# EAGLE design in3temperature (EAGLE 8.0.0)
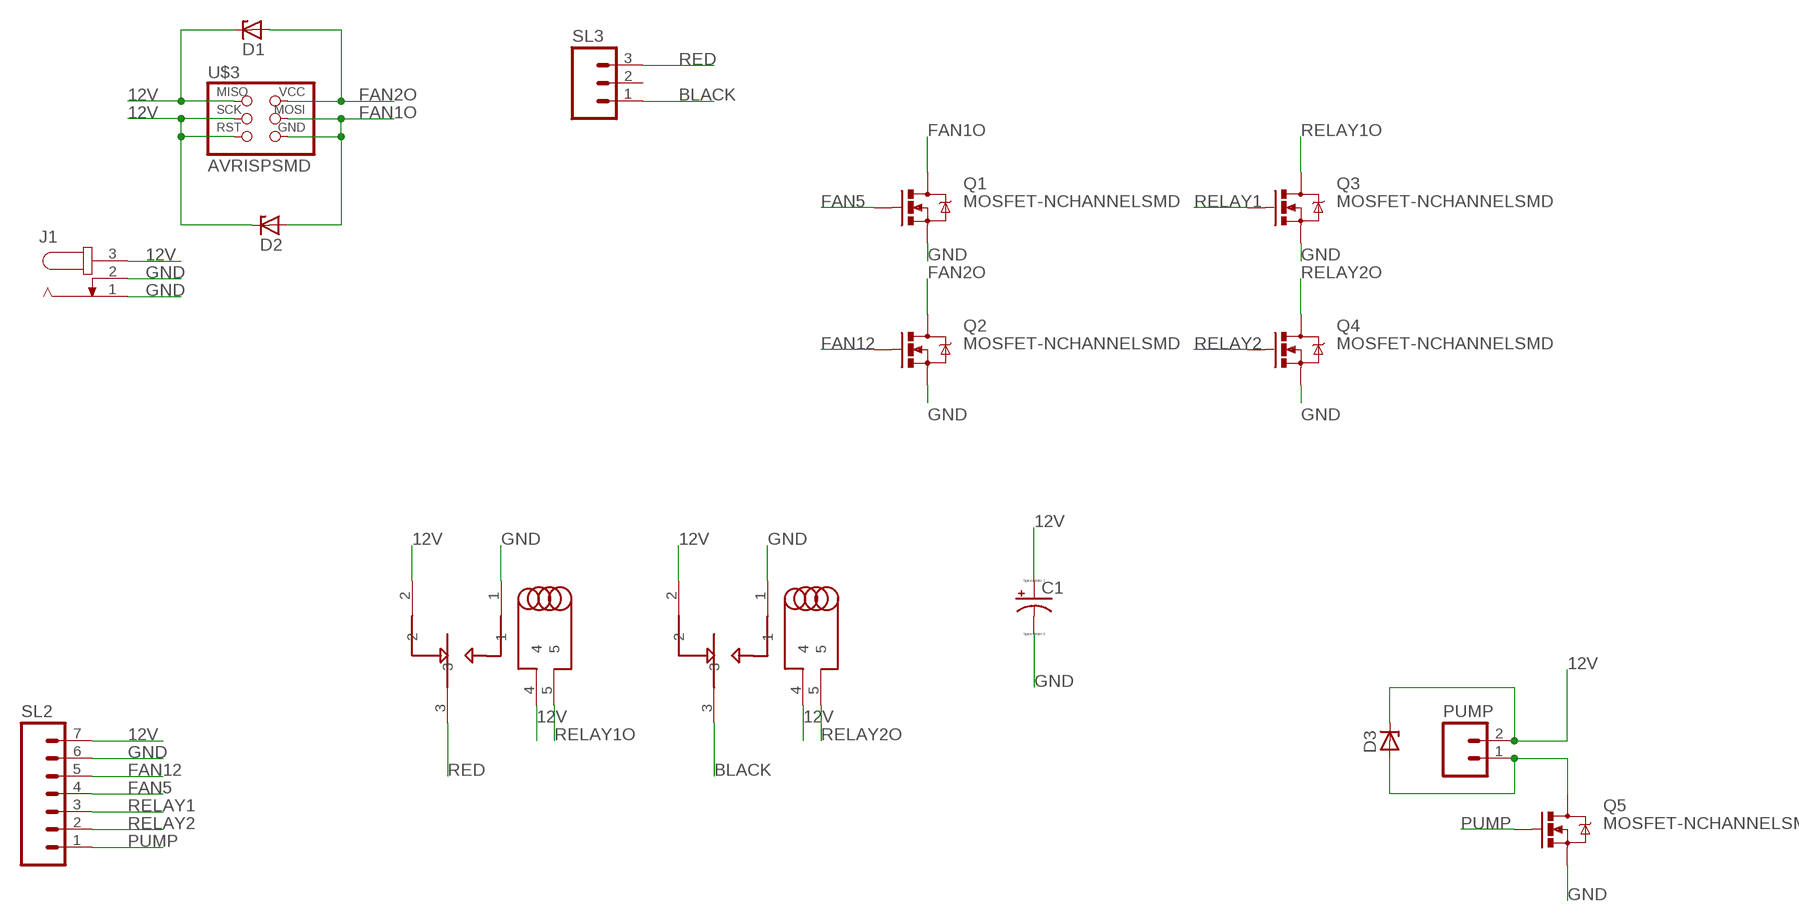
[diagram p0: schematic, sheet 1]

## Parts
C1  CPOL-USE2.5-5  [E2,5-5]
D1  ZENER_DIODESOD123  [SOD123]
D2  ZENER_DIODESOD123  [SOD123]
D3  ZENER_DIODESOD123  [SOD123]
J1  JACK-PLUG1  [SPC4078]
PUMP  MA02  [02PA]
Q1  MOSFET-NCHANNELSMD  [SOT23-3]
Q2  MOSFET-NCHANNELSMD  [SOT23-3]
Q3  MOSFET-NCHANNELSMD  [SOT23-3]
Q4  MOSFET-NCHANNELSMD  [SOT23-3]
Q5  MOSFET-NCHANNELSMD  [SOT23-3]
SL2  MA07  [07PA]
SL3  MA03  [03P]
U$1  RELAY-V23092THROUGH_HOLE  [RELAY-V23092]
U$2  RELAY-V23092THROUGH_HOLE  [RELAY-V23092]
U$3  AVRISPSMD  [2X03SMD]

## Nets
12V: C1.+ D1.CATHODE D2.CATHODE D3.CATHODE J1.3 PUMP.2 SL2.7 U$1.2 U$1.4 U$2.2 U$2.4 U$3.1(MISO) U$3.3(SCK) U$3.5(RST)
BLACK: SL3.1 U$2.3
FAN1O: D2.ANODE Q1.3(D) U$3.4(MOSI) U$3.6(GND)
FAN2O: D1.ANODE Q2.3(D) U$3.2(VCC)
FAN5: Q1.1(G) SL2.4
FAN12: Q2.1(G) SL2.5
GND: C1.- J1.1 J1.2 Q1.2(S) Q2.2(S) Q3.2(S) Q4.2(S) Q5.2(S) SL2.6 U$1.1 U$2.1
N$3: D3.ANODE PUMP.1 Q5.3(D)
PUMP: Q5.1(G) SL2.1
RED: SL3.3 U$1.3
RELAY1: Q3.1(G) SL2.3
RELAY1O: Q3.3(D) U$1.5
RELAY2: Q4.1(G) SL2.2
RELAY2O: Q4.3(D) U$2.5
Unconnected: SL3.2

## Library data of the parts
C1 = resistor:CPOL-US: POLARIZED CAPACITOR, American symbol
D1-D3 = fab:ZENER_DIODE: zener diode
J1 = con-jack:JACK-PLUG: DC POWER JACK Power Jack, DC, Right Angle, Through Hole, Rated 5A at 16VDC, PC Terminals Distributor: Farnell (www.Farnell.de) Drawing: 84N1161.pdf / 84N1162.pdf Manufacturer: SPC Technology (www.spctechnology.com) Type: SPC4077 / SPC 4078; OC_FARNELL: unknown; OC_NEWARK: unknown
PUMP = con-amp-quick:MA02: AMP QUICK CONNECTOR; OC_FARNELL: unknown; OC_NEWARK: unknown
Q1-Q5 = 01_SparkFun:MOSFET-NCHANNEL
SL2 = con-amp-quick:MA07: AMP QUICK CONNECTOR; OC_FARNELL: unknown; OC_NEWARK: unknown
SL3 = con-amp-quick:MA03: AMP QUICK CONNECTOR; OC_FARNELL: unknown; OC_NEWARK: unknown
U$1 U$2 = 0001_alejandro:RELAY-V23092
U$3 = 01_FAB_Hello:AVRISP

## Board
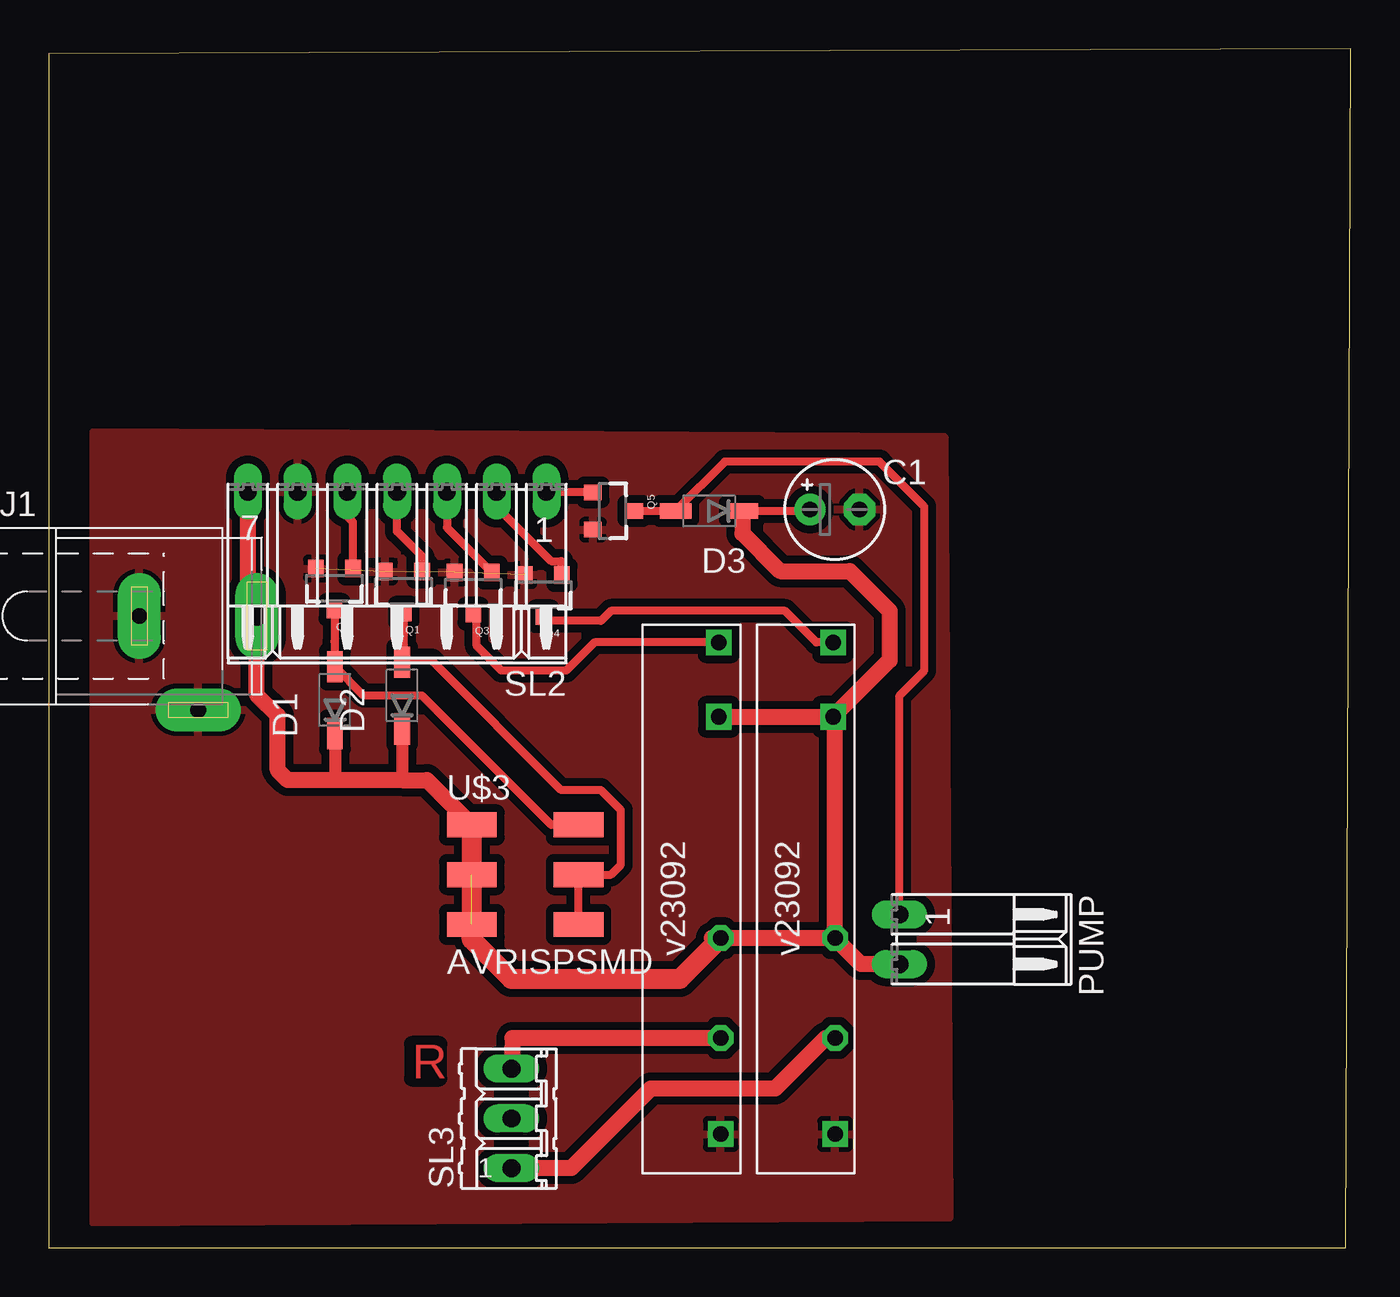
[diagram p1: board, top side]

Size 66.47 x 61.2 mm. Coordinates in mm from the lower left corner, seen from the top.
Outline: 0,0 66.22,0 66.47,61.2 0,60.95 0,0
Copper layers (1*16): Top 0.035mm / dielectric 1.5mm / Bottom 0.035mm
Design rules "default *": minimum track width 10mil, minimum drill 24mil, track to track 16mil, track to pad 16mil, pad to pad 16mil, via to via 16mil, smd to smd 16mil, copper to edge 40mil, drill to drill 8mil, minimum pad ring 10mil, minimum via ring 8mil, stop-mask expansion 4mil, vias tented up to drill 0mil, thermal gap 10mil

### Footprints (pad centres in the part's own frame; a part is rotated, then mirrored left to right if it is on the bottom)
E2,5-5 = drill 0.813 pad 1.6: + -1.27,0 | drill 0.813 pad 1.6 octagon: - 1.27,0
SOD123 = smd 1.6 x 0.8: ANODE 1.7,0; CATHODE -1.7,0
SPC4078 = drill 0.8 pad 2.184 long: 1 -3,0; 2 0,-4.8 | drill 1 pad 2.184 long: 3 3,0
02PA = drill 0.914 long: 1 -1.27,0; 2 1.27,0
SOT23-3 = smd 0.8 x 0.9: 1 -0.95,-1; 2 0.95,-1; 3 0,1.1
07PA = drill 0.914 long: 1 -7.62,0; 2 -5.08,0; 3 -2.54,0; 4 0,0; 5 2.54,0; 6 5.08,0; 7 7.62,0
03P = drill 0.914 long: 1 -2.54,0; 2 0,0; 3 2.54,0
RELAY-V23092 = drill 0.8 square: 1 2,1; 4 23.3,1.1; 5 27.1,1.1 | drill 0.8 octagon: 2 12,1; 3 6.9,1
2X03SMD = smd 2.54 x 1.27: 1 -2.54,2.54; 2 2.92,2.54; 3 -2.54,0; 4 2.92,0; 5 -2.54,-2.54; 6 2.92,-2.54

### Placement (x,y rotation side)
C1  40.13,37.69 0 top
D1  14.61,27.97 90 top
D2  18.03,28.19 90 top
D3  33.71,37.62 180 top
J1  7.62,32.26 0 top
PUMP  43.43,15.75 270 top
Q1  18.11,33.53 180 top
Q2  14.58,33.68 180 top
Q3  21.67,33.48 180 top
Q4  25.25,33.35 180 top
Q5  28.78,37.62 270 top
SL2  17.78,38.61 180 top
SL3  23.62,6.6 90 top
U$1  35.31,3.81 90 top
U$2  41.15,3.81 90 top
U$3  24.13,19.05 0 top

### Tracks (layer width: path | path; a pad name or v marks a point on that pad's centre or on a via)
12V  (1 unrouted)
  Top 0.406: 22.35,21.59 U$3.1 | D3.CATHODE 38.53,37.62 C1.+
  Top 0.61: D1.CATHODE 14.61,24 14.48,23.88 | D2.CATHODE 18.03,23.88
  Top 0.813: SL2.7 10.16,32.72 J1.3 10.62,28.24 11.68,27.18 11.68,24.38 12.19,23.88 14.48,23.88 18.03,23.88 19.3,23.88 U$3.1 | U$2.2 U$1.2 33.84,15.81 | U$1.4 U$2.4 | U$2.2 40.15,27.01 U$2.4 | D3.CATHODE 35.41,36.48 37.34,34.54 40.89,34.54 42.93,32.51 42.93,29.99 U$2.4 | PUMP.2 41.48,14.48 U$2.2
  Top 1.016: U$1.2 32.21,13.72 23.62,13.72 21.59,15.75 U$3.5 U$3.1
BLACK
  Top 0.813: U$2.3 39.67,10.71 37.08,8.13 30.73,8.13 26.67,4.06 SL3.1
FAN1O
  Top 0.406: Q1.3 18.11,29.97 D2.ANODE 18.11,29.97 19.56,29.97 26.16,23.37 28.19,23.37 29.21,22.35 29.21,19.56 28.7,19.05 U$3.4 U$3.6
FAN2O
  Top 0.406: Q2.3 14.58,30.96 D1.ANODE 16.08,28.19 19.05,28.19 25.65,21.59 U$3.2
FAN5
  Top 0.406: Q1.1 19.06,35.3 17.78,36.58 SL2.4
FAN12
  Top 0.406: Q2.1 15.53,37.05 15.24,37.34 SL2.5
GND  (3 unrouted)
  pour Top: 45.72,41.4 45.97,1.52 2.29,1.27 2.29,41.66
N$3
  Top 0.406: Q5.3 D3.ANODE 34.52,40.13 42.42,40.13 44.7,37.85 44.7,29.46 43.43,28.19 PUMP.1
PUMP
  Top 0.406: SL2.1 27.74,38.61 Q5.1
RED
  Top 0.813: U$1.3 23.66,10.71 SL3.3
RELAY1
  Top 0.406: SL2.3 20.32,36.77 Q3.1
RELAY1O
  Top 0.406: U$1.5 27.86,30.91 26.42,29.46 23.11,29.46 21.84,30.73 21.84,32.2 Q3.3
RELAY2
  Top 0.406: SL2.2 22.86,37.85 25.65,35.05 26.16,35.05 26.16,34.39 Q4.1
RELAY2O
  Top 0.406: Q4.3 25.49,32 28.19,32 28.7,32.51 37.59,32.51 39.19,30.91 U$2.5

### Text on the board
Top: R